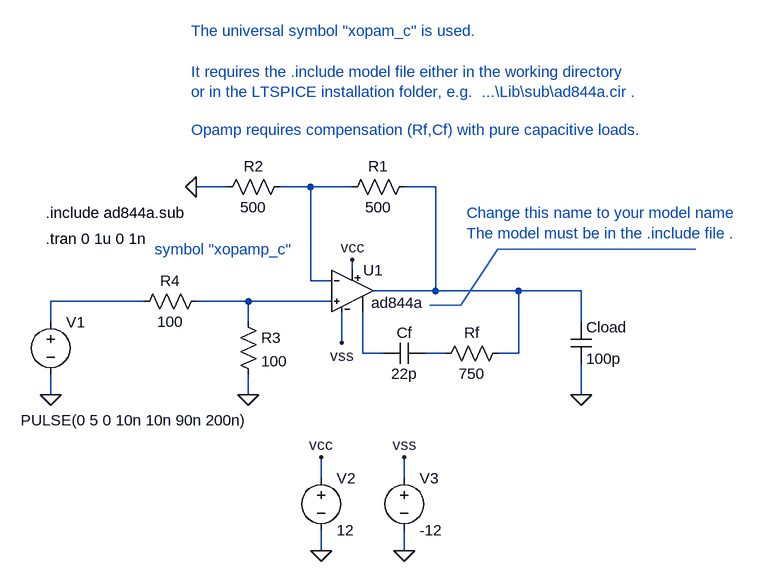
[diagram p0: schematic ad844_test2.asc]
ad844_test2.asc, the LTspice schematic file:
Version 4
SHEET 1 880 680
WIRE 144 0 80 0
WIRE -48 0 -96 0
WIRE 224 0 272 0
WIRE 272 0 272 160
WIRE 272 160 176 160
WIRE 112 144 80 144
WIRE 80 144 80 0
WIRE 80 0 32 0
WIRE 112 176 -16 176
WIRE 128 192 128 240
WIRE 144 128 144 112
WIRE -16 208 -16 176
WIRE -16 176 -96 176
WIRE -16 288 -16 320
WIRE -176 176 -320 176
WIRE -320 176 -320 208
WIRE -320 288 -320 320
WIRE 272 160 400 160
WIRE 160 192 160 256
WIRE 160 256 192 256
WIRE 256 256 288 256
WIRE 368 256 400 256
WIRE 400 256 400 160
WIRE 96 448 96 416
WIRE 224 448 224 416
WIRE 96 528 96 560
WIRE 224 528 224 560
WIRE 400 160 496 160
WIRE 496 160 496 208
WIRE 496 272 496 320
FLAG 144 112 vcc
FLAG 128 240 vss
FLAG -96 0 0
FLAG -16 320 0
FLAG -320 320 0
FLAG 224 560 0
FLAG 96 560 0
FLAG 96 416 vcc
FLAG 224 416 vss
FLAG 496 320 0
SYMBOL res 128 16 R270
WINDOW 0 32 56 VTop 0
WINDOW 3 0 56 VBottom 0
SYMATTR InstName R1
SYMATTR Value 500
SYMBOL res -64 16 R270
WINDOW 0 32 56 VTop 0
WINDOW 3 0 56 VBottom 0
SYMATTR InstName R2
SYMATTR Value 500
SYMBOL res -32 192 R0
SYMATTR InstName R3
SYMATTR Value 100
SYMBOL res -192 192 R270
WINDOW 0 32 56 VTop 0
WINDOW 3 0 56 VBottom 0
SYMATTR InstName R4
SYMATTR Value 100
SYMBOL voltage -320 192 R0
WINDOW 3 -46 167 Left 0
WINDOW 123 0 0 Left 0
WINDOW 39 0 0 Left 0
SYMATTR Value PULSE(0 5 0 10n 10n 90n 200n)
SYMATTR InstName V1
SYMBOL cap 192 272 R270
WINDOW 0 32 32 VTop 0
WINDOW 3 0 32 VBottom 0
SYMATTR InstName Cf
SYMATTR Value 22p
SYMBOL res 272 272 R270
WINDOW 0 32 56 VTop 0
WINDOW 3 0 56 VBottom 0
SYMATTR InstName Rf
SYMATTR Value 750
SYMBOL voltage 96 432 R0
SYMATTR InstName V2
SYMATTR Value 12
SYMBOL voltage 224 432 R0
SYMATTR InstName V3
SYMATTR Value -12
SYMBOL cap 480 208 R0
SYMATTR InstName Cload
SYMATTR Value 100p
SYMBOL xopamp_c 144 96 R0
SYMATTR InstName U1
SYMATTR Value ad844a
TEXT -328 80 Left 0 !.tran 0 1u 0 1n
TEXT -104 -88 Left 0 ;Opamp requires compensation (Rf,Cf) with pure capacitive loads.
TEXT -104 -240 Left 0 ;The universal symbol "xopam_c" is used.\n \nIt requires the .include model file either in the working directory\nor in the LTSPICE installation folder, e.g.  ...\\Lib\\sub\\ad844a.cir .
TEXT -328 40 Left 0 !.include ad844a.sub
TEXT -160 96 Left 0 ;symbol "xopamp_c"
TEXT 320 40 Left 0 ;Change this name to your model name\nThe model must be in the .include file .
LINE Normal 311 182 263 182
LINE Normal 368 96 311 182
LINE Normal 672 96 368 96

The netlist it stands for:
* ad844_test2.asc
R1 N001 N002 500
R2 0 N001 500
R3 N003 0 100
R4 N004 N003 100
V1 N004 0 PULSE(0 5 0 10n 10n 90n 200n)
Cf N005 N006 22p
Rf N006 N002 750
V2 vcc 0 12
V3 vss 0 -12
Cload N002 0 100p
XU1 N003 N001 vcc vss N002 N005 ad844a  ; pins In+ In- V+ V- OUT COMP
.tran 0 1u 0 1n
* Opamp requires compensation (Rf,Cf) with pure capacitive loads.
* The universal symbol "xopam_c" is used.
* It requires the .include model file either in the working directory
* or in the LTSPICE installation folder, e.g.  ...\Lib\sub\ad844a.cir .
.include ad844a.sub
* symbol "xopamp_c"
* Change this name to your model name
* The model must be in the .include file .
.backanno
.end